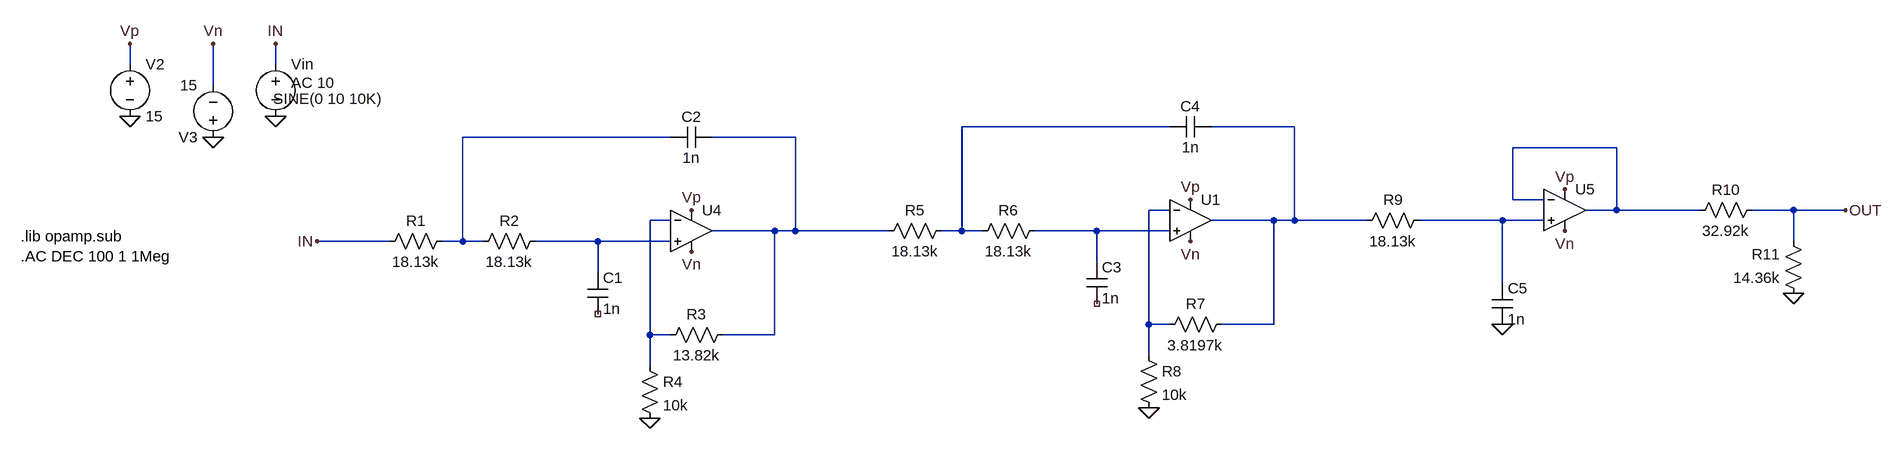
[diagram p0: schematic matlab1.asc]
matlab1.asc, the LTspice schematic file:
Version 4
SHEET 1 2244 680
WIRE -464 -112 -464 -144
WIRE -240 -112 -240 -144
WIRE -336 -80 -336 -144
WIRE 1136 -16 816 -16
WIRE 1328 -16 1200 -16
WIRE 368 0 48 0
WIRE 560 0 432 0
WIRE 1824 16 1664 16
WIRE 1664 96 1664 16
WIRE 1712 96 1664 96
WIRE 1136 112 1104 112
WIRE 1824 112 1824 16
WIRE 1824 112 1776 112
WIRE 1952 112 1824 112
WIRE 2096 112 2032 112
WIRE 2176 112 2096 112
WIRE 368 128 336 128
WIRE 1296 128 1200 128
WIRE 1328 128 1328 -16
WIRE 1328 128 1296 128
WIRE 1440 128 1328 128
WIRE 1648 128 1520 128
WIRE 1712 128 1648 128
WIRE 528 144 432 144
WIRE 560 144 560 0
WIRE 560 144 528 144
WIRE 704 144 560 144
WIRE 816 144 816 -16
WIRE 816 144 784 144
WIRE 848 144 816 144
WIRE 1024 144 928 144
WIRE 1136 144 1024 144
WIRE -64 160 -176 160
WIRE 48 160 48 0
WIRE 48 160 16 160
WIRE 80 160 48 160
WIRE 256 160 160 160
WIRE 368 160 256 160
WIRE 2096 160 2096 112
WIRE 1024 192 1024 144
WIRE 256 208 256 160
WIRE 1648 224 1648 128
WIRE 1104 288 1104 112
WIRE 1136 288 1104 288
WIRE 1296 288 1296 128
WIRE 1296 288 1216 288
WIRE 336 304 336 128
WIRE 368 304 336 304
WIRE 528 304 528 144
WIRE 528 304 448 304
WIRE 1104 336 1104 288
WIRE 336 352 336 304
FLAG -240 -32 0
FLAG 336 432 0
FLAG -464 -32 0
FLAG -464 -144 Vp
FLAG -336 -144 Vn
FLAG 400 176 Vn
FLAG 400 112 Vp
FLAG 1104 416 0
FLAG 1168 160 Vn
FLAG 1168 96 Vp
FLAG 1744 144 Vn
FLAG 1744 80 Vp
FLAG 1648 288 0
FLAG 2096 240 0
FLAG 2176 112 OUT
FLAG -240 -144 IN
FLAG -176 160 IN
FLAG -336 0 0
SYMBOL res 32 144 R90
WINDOW 0 0 56 VBottom 2
WINDOW 3 32 56 VTop 2
SYMATTR InstName R1
SYMATTR Value 18.13k
SYMBOL res 176 144 R90
WINDOW 0 0 56 VBottom 2
WINDOW 3 32 56 VTop 2
SYMATTR InstName R2
SYMATTR Value 18.13k
SYMBOL cap 240 208 R0
SYMATTR InstName C1
SYMATTR Value 1n
SYMBOL voltage -240 -128 R0
WINDOW 3 -4 69 Left 2
WINDOW 123 24 44 Left 2
WINDOW 39 0 0 Left 0
SYMATTR InstName Vin
SYMATTR Value SINE(0 10 10K)
SYMATTR Value2 AC 10
SYMBOL cap 432 -16 R90
WINDOW 0 0 32 VBottom 2
WINDOW 3 32 32 VTop 2
SYMATTR InstName C2
SYMATTR Value 1n
SYMBOL res 464 288 R90
WINDOW 0 0 56 VBottom 2
WINDOW 3 32 56 VTop 2
SYMATTR InstName R3
SYMATTR Value 13.82k
SYMBOL res 320 336 R0
SYMATTR InstName R4
SYMATTR Value 10k
SYMBOL voltage -464 -128 R0
WINDOW 123 0 0 Left 0
WINDOW 39 0 0 Left 0
SYMATTR InstName V2
SYMATTR Value 15
SYMBOL voltage -336 16 R180
WINDOW 123 0 0 Left 0
WINDOW 39 0 0 Left 0
SYMATTR InstName V3
SYMATTR Value 15
SYMBOL res 800 128 R90
WINDOW 0 0 56 VBottom 2
WINDOW 3 32 56 VTop 2
SYMATTR InstName R5
SYMATTR Value 18.13k
SYMBOL res 944 128 R90
WINDOW 0 0 56 VBottom 2
WINDOW 3 32 56 VTop 2
SYMATTR InstName R6
SYMATTR Value 18.13k
SYMBOL cap 1008 192 R0
SYMATTR InstName C3
SYMATTR Value 1n
SYMBOL cap 1200 -32 R90
WINDOW 0 0 32 VBottom 2
WINDOW 3 32 32 VTop 2
SYMATTR InstName C4
SYMATTR Value 1n
SYMBOL res 1232 272 R90
WINDOW 0 0 56 VBottom 2
WINDOW 3 32 56 VTop 2
SYMATTR InstName R7
SYMATTR Value 3.8197k
SYMBOL res 1088 320 R0
SYMATTR InstName R8
SYMATTR Value 10k
SYMBOL res 1536 112 R90
WINDOW 0 0 56 VBottom 2
WINDOW 3 32 56 VTop 2
SYMATTR InstName R9
SYMATTR Value 18.13k
SYMBOL cap 1632 224 R0
SYMATTR InstName C5
SYMATTR Value 1n
SYMBOL res 2048 96 R90
WINDOW 0 0 56 VBottom 2
WINDOW 3 32 56 VTop 2
SYMATTR InstName R10
SYMATTR Value 32.92k
SYMBOL res 2112 256 R180
WINDOW 0 36 76 Left 2
WINDOW 3 36 40 Left 2
SYMATTR InstName R11
SYMATTR Value 14.36k
SYMBOL OpAmps\\UniversalOpAmp2 400 144 R0
SYMATTR InstName U4
SYMBOL OpAmps\\UniversalOpAmp2 1168 128 R0
SYMATTR InstName U1
SYMBOL OpAmps\\UniversalOpAmp2 1744 112 R0
SYMATTR InstName U5
TEXT -632 152 Left 2 !.lib opamp.sub\n.AC DEC 100 1 1Meg

The netlist it stands for:
* matlab1.asc
R1 N003 IN 18.13k
R2 N010 N003 18.13k
C1 N010 NC_01 1n
Vin IN 0 SINE(0 10 10K) AC 10
C2 N004 N003 1n
R3 N004 N007 13.82k
R4 N007 0 10k
V2 Vp 0 15
V3 0 Vn 15
R5 N001 N004 18.13k
R6 N009 N001 18.13k
C3 N009 NC_02 1n
C4 N002 N001 1n
R7 N002 N006 3.8197k
R8 N006 0 10k
R9 N008 N002 18.13k
C5 N008 0 1n
R10 OUT N005 32.92k
R11 0 OUT 14.36k
XU4 N010 N007 Vp Vn N004 level2 Avol=1Meg GBW=10Meg Slew=10Meg Ilimit=25m Rail=0 Vos=0 En=0 Enk=0 In=0 Ink=0 Rin=500Meg  ; pins In+ In- V+ V- OUT
XU1 N009 N006 Vp Vn N002 level2 Avol=1Meg GBW=10Meg Slew=10Meg Ilimit=25m Rail=0 Vos=0 En=0 Enk=0 In=0 Ink=0 Rin=500Meg  ; pins In+ In- V+ V- OUT
XU5 N008 N005 Vp Vn N005 level2 Avol=1Meg GBW=10Meg Slew=10Meg Ilimit=25m Rail=0 Vos=0 En=0 Enk=0 In=0 Ink=0 Rin=500Meg  ; pins In+ In- V+ V- OUT
.lib opamp.sub
.AC DEC 100 1 1Meg
.lib UniversalOpAmp2.lib
.backanno
.end